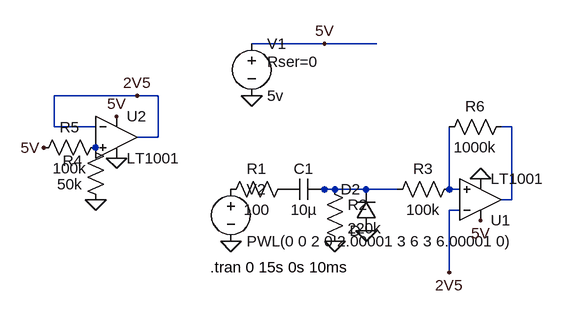
[diagram p0: schematic simulation2.asc]
simulation2.asc, the LTspice schematic file:
Version 4
SHEET 1 880 680
WIRE -192 -64 -304 -64
WIRE -112 -64 -192 -64
WIRE -480 16 -608 16
WIRE -448 16 -480 16
WIRE -608 64 -608 16
WIRE -544 64 -608 64
WIRE 96 64 80 64
WIRE -448 80 -448 16
WIRE -448 80 -480 80
WIRE -192 160 -208 160
WIRE -176 160 -192 160
WIRE -128 160 -176 160
WIRE -80 160 -128 160
WIRE 0 160 0 64
WIRE 16 160 0 160
WIRE 96 176 96 64
WIRE 96 176 80 176
WIRE 16 192 0 192
WIRE 0 288 0 192
FLAG -336 240 0
FLAG -304 16 0
FLAG -176 240 0
FLAG -128 224 0
FLAG -192 -64 5V
FLAG -624 96 5V
FLAG -544 176 0
FLAG 48 144 0
FLAG -512 48 5V
FLAG -512 112 0
FLAG -480 16 2V5
FLAG 48 208 5V
FLAG 0 288 2V5
SYMBOL cap -192 144 R90
WINDOW 0 0 32 VBottom 2
WINDOW 3 32 32 VTop 2
SYMATTR InstName C1
SYMATTR Value 10µ
SYMBOL voltage -304 -80 R0
WINDOW 123 0 0 Left 2
WINDOW 39 24 44 Left 2
SYMATTR SpiceLine Rser=0
SYMATTR InstName V1
SYMATTR Value 5v
SYMBOL voltage -336 144 R0
WINDOW 123 0 0 Left 2
WINDOW 39 0 0 Left 2
SYMATTR InstName V2
SYMATTR Value PWL(0 0 2 0 2.00001 3 6 3 6.00001 0)
SYMBOL res -192 144 R0
SYMATTR InstName R2
SYMATTR Value 220k
SYMBOL diode -112 224 R180
WINDOW 0 24 64 Left 2
WINDOW 3 24 0 Left 2
SYMATTR InstName D2
SYMBOL Opamps\\LT1001 48 240 M180
SYMATTR InstName U1
SYMBOL res -528 192 R180
WINDOW 0 36 76 Left 2
WINDOW 3 36 40 Left 2
SYMATTR InstName R4
SYMATTR Value 50k
SYMBOL res -640 112 R270
WINDOW 0 32 56 VTop 2
WINDOW 3 0 56 VBottom 2
SYMATTR InstName R5
SYMATTR Value 100k
SYMBOL Opamps\\LT1001 -512 16 R0
SYMATTR InstName U2
SYMBOL res -240 144 R90
WINDOW 0 0 56 VBottom 2
WINDOW 3 32 56 VTop 2
SYMATTR InstName R1
SYMATTR Value 100
SYMBOL res 16 144 R90
WINDOW 0 0 56 VBottom 2
WINDOW 3 32 56 VTop 2
SYMATTR InstName R3
SYMATTR Value 100k
SYMBOL res 96 48 R90
WINDOW 0 0 56 VBottom 2
WINDOW 3 32 56 VTop 2
SYMATTR InstName R6
SYMATTR Value 1000k
TEXT -368 280 Left 2 !.tran 0 15s 0s 10ms

The netlist it stands for:
* simulation2.asc
C1 N002 P001 10µ
V1 5V 0 5v Rser=0
V2 P002 0 PWL(0 0 2 0 2.00001 3 6 3 6.00001 0)
R2 N002 0 220k
D2 0 N002 D
XU1 N003 2V5 5V 0 N001 LT1001  ; pins In+ In- V+ V- OUT
R4 0 P003 50k
R5 5V P003 100k
XU2 P003 2V5 5V 0 2V5 LT1001  ; pins In+ In- V+ V- OUT
R1 P001 P002 100
R3 N003 N002 100k
R6 N001 N003 1000k
.model D D
.lib standard.dio
.tran 0 15s 0s 10ms
.lib LTC.lib
.backanno
.end